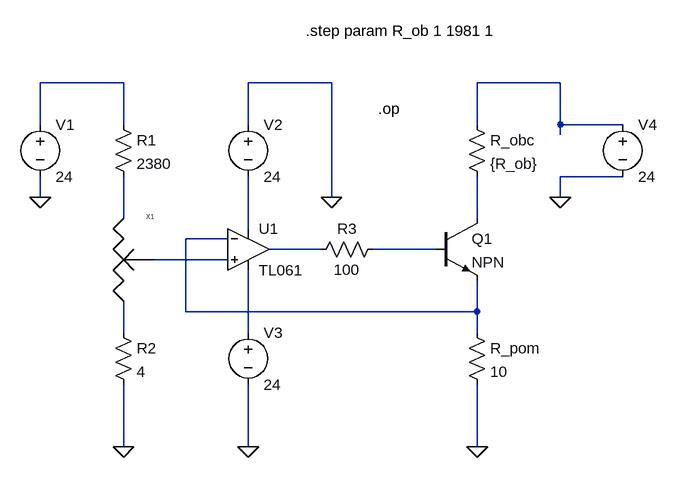
[diagram p0: schematic pierwszy.asc]
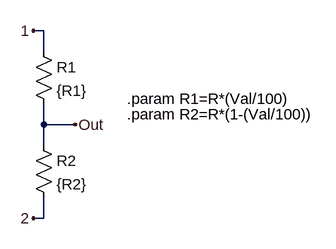
[diagram p1: sub-circuit potentiometer.asc]
pierwszy.asc, the LTspice schematic file:
Version 4
SHEET 1 1624 680
WIRE 800 64 672 64
WIRE 1120 64 992 64
WIRE 1472 64 1344 64
WIRE 672 128 672 64
WIRE 800 128 800 64
WIRE 992 128 992 64
WIRE 1344 128 1344 64
WIRE 1472 128 1472 64
WIRE 1568 128 1472 128
WIRE 1472 144 1472 128
WIRE 1568 208 1472 208
WIRE 672 240 672 208
WIRE 1120 240 1120 64
WIRE 1472 240 1472 208
WIRE 800 272 800 208
WIRE 1344 272 1344 208
WIRE 992 288 992 208
WIRE 960 304 896 304
WIRE 1104 320 1024 320
WIRE 1280 320 1184 320
WIRE 960 336 848 336
WIRE 896 416 896 304
WIRE 1344 416 1344 368
WIRE 1344 416 896 416
WIRE 800 448 800 400
WIRE 992 448 992 352
WIRE 1344 448 1344 416
WIRE 800 624 800 528
WIRE 992 624 992 528
WIRE 1344 624 1344 528
FLAG 1472 240 0
FLAG 672 240 0
FLAG 1120 240 0
FLAG 1344 624 0
FLAG 992 624 0
FLAG 800 624 0
SYMBOL voltage 672 112 R0
WINDOW 123 0 0 Left 0
WINDOW 39 0 0 Left 0
SYMATTR InstName V1
SYMATTR Value 24
SYMBOL voltage 992 112 R0
WINDOW 123 0 0 Left 0
WINDOW 39 0 0 Left 0
SYMATTR InstName V2
SYMATTR Value 24
SYMBOL voltage 992 432 R0
WINDOW 123 0 0 Left 0
WINDOW 39 0 0 Left 0
SYMATTR InstName V3
SYMATTR Value 24
SYMBOL voltage 1568 112 R0
WINDOW 123 0 0 Left 0
WINDOW 39 0 0 Left 0
SYMATTR InstName V4
SYMATTR Value 24
SYMBOL res 784 112 R0
SYMATTR InstName R1
SYMATTR Value 2380
SYMBOL res 784 432 R0
SYMATTR InstName R2
SYMATTR Value 4
SYMBOL res 1200 304 R90
WINDOW 0 0 56 VBottom 2
WINDOW 3 32 56 VTop 2
SYMATTR InstName R3
SYMATTR Value 100
SYMBOL res 1328 112 R0
SYMATTR InstName R_obc
SYMATTR Value {R_ob}
SYMBOL Opamps\\UniversalOpamp2 992 320 R0
SYMATTR InstName U1
SYMATTR Value TL061
SYMBOL Potentiometer 800 336 R0
SYMATTR InstName X1
SYMATTR SpiceLine R=40,Val=50
SYMBOL res 1328 432 R0
SYMATTR InstName R_pom
SYMATTR Value 10
SYMBOL npn 1280 272 R0
SYMATTR InstName Q1
TEXT 1192 104 Left 2 !.op
TEXT 1080 -16 Left 2 !.step param R_ob 1 1981 1

potentiometer.asc, the sub-circuit schematic file:
Version 4
SHEET 1 880 680
WIRE 144 16 128 16
WIRE 144 48 144 16
WIRE 144 160 144 128
WIRE 192 160 144 160
WIRE 144 192 144 160
WIRE 144 304 144 272
WIRE 144 304 128 304
FLAG 128 16 1
FLAG 128 304 2
FLAG 192 160 Out
SYMBOL res 128 32 R0
SYMATTR InstName R1
SYMATTR Value {R1}
SYMBOL res 128 176 R0
SYMATTR InstName R2
SYMATTR Value {R2}
TEXT 272 120 Left 2 !.param R1=R*(Val/100)
TEXT 272 144 Left 2 !.param R2=R*(1-(Val/100))

The netlist it stands for:
* pierwszy.asc
V1 N001 0 24
V2 0 N005 24
V3 N011 0 24
V4 N002 0 24
R1 N001 N003 2380
R2 N010 0 4
R3 N008 N007 100
R_obc N002 N004 {R_ob}
XU1 N009 N006 N005 N011 N007 level.2 TL061 Avol=1Meg GBW=10Meg Slew=10Meg ilimit=25m rail=0 Vos=0 phimargin=45 en=0 enk=0 in=0 ink=0 Rin=500Meg  ; pins IN+ IN- V+ V- OUT
XX1 N003 N010 N009 potentiometer params: R=40,Val=50
R_pom N006 0 10
Q1 N004 N008 N006 0 NPN

* block symbol definitions
.subckt potentiometer 1 2 Out
R1 1 Out {R1}
R2 Out 2 {R2}
.param R1=R*(Val/100)
.param R2=R*(1-(Val/100))
.ends potentiometer

.model NPN NPN
.model PNP PNP
.lib standard.bjt
.op
.step param R_ob 1 1981 1
.lib UniversalOpamps2.sub
.backanno
.end